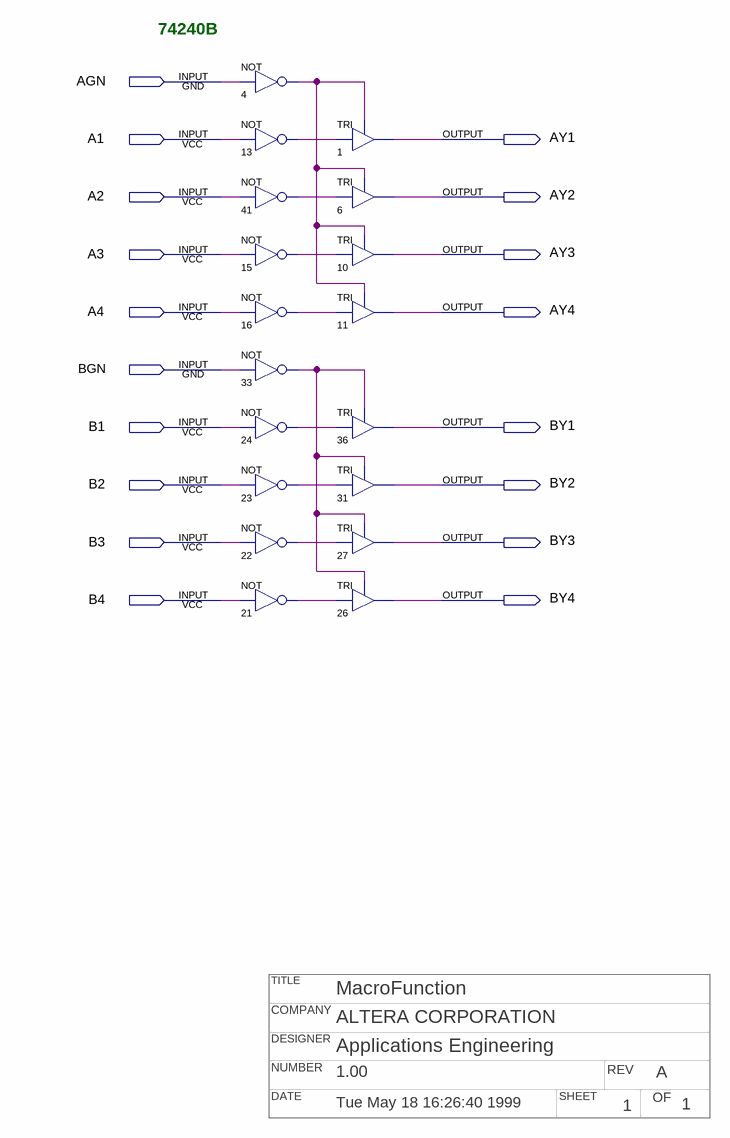
[diagram p0: schematic sheet]
// Quartus schematic 74240b.bdf as structural Verilog: 18 symbols, 18 pins
// Title block: TITLE: MacroFunction; COMPANY: ALTERA CORPORATION; DESIGNER: Applications Engineering; NUMBER: 1.00; REV: A; DATE: Tue May 18 16:26:40 1999; SHEET: 1; OF: 1
module \74240b  (
  input  AGN,
  input  A1,
  input  A2,
  input  A3,
  input  A4,
  input  BGN,
  input  B1,
  input  B2,
  input  B3,
  input  B4,
  output AY1,
  output AY2,
  output AY3,
  output AY4,
  output BY1,
  output BY2,
  output BY3,
  output BY4
);

  wire n4_out, n13_out, n15_out, n16_out, n21_out, n22_out, n23_out, n24_out, n33_out, n41_out;

  not u_4 (n4_out, AGN);
  not u_13 (n13_out, A1);
  not u_41 (n41_out, A2);
  not u_15 (n15_out, A3);
  not u_16 (n16_out, A4);
  not u_33 (n33_out, BGN);
  not u_24 (n24_out, B1);
  not u_23 (n23_out, B2);
  not u_22 (n22_out, B3);
  not u_21 (n21_out, B4);
  TRI u_1 (.IN(n13_out), .OE(n4_out), .OUT(AY1));
  TRI u_6 (.IN(n41_out), .OE(n4_out), .OUT(AY2));
  TRI u_10 (.IN(n15_out), .OE(n4_out), .OUT(AY3));
  TRI u_11 (.IN(n16_out), .OE(n4_out), .OUT(AY4));
  TRI u_36 (.IN(n24_out), .OE(n33_out), .OUT(BY1));
  TRI u_31 (.IN(n23_out), .OE(n33_out), .OUT(BY2));
  TRI u_27 (.IN(n22_out), .OE(n33_out), .OUT(BY3));
  TRI u_26 (.IN(n21_out), .OE(n33_out), .OUT(BY4));

  // Notes on the sheet:
  //   74240B
endmodule
